# EAGLE design manga-screen (EAGLE 5.12)
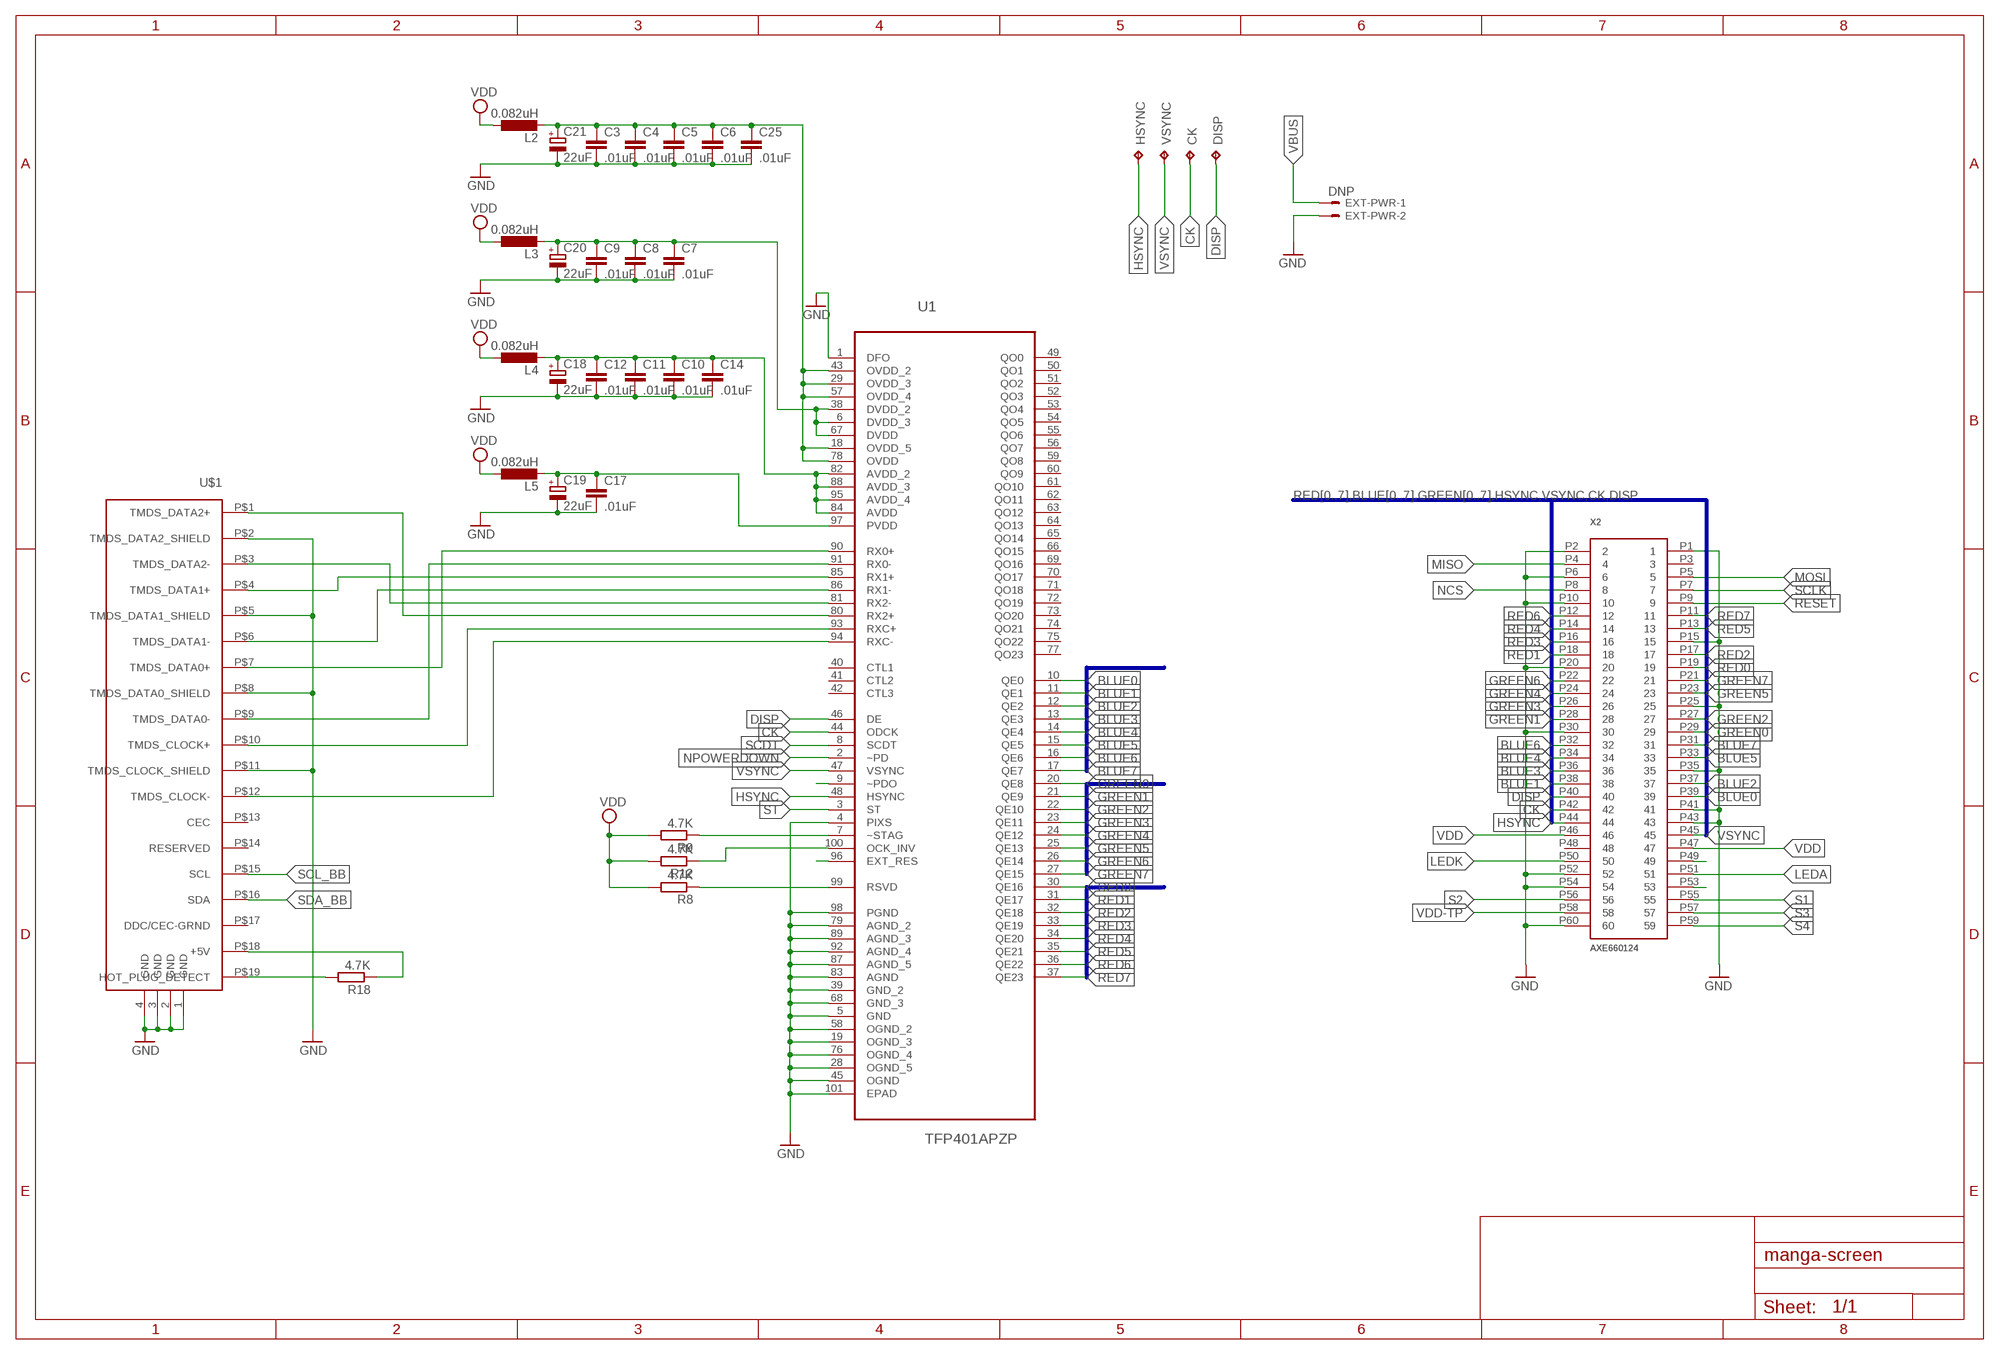
[diagram p0: schematic, sheet 1, part 1 of 2]
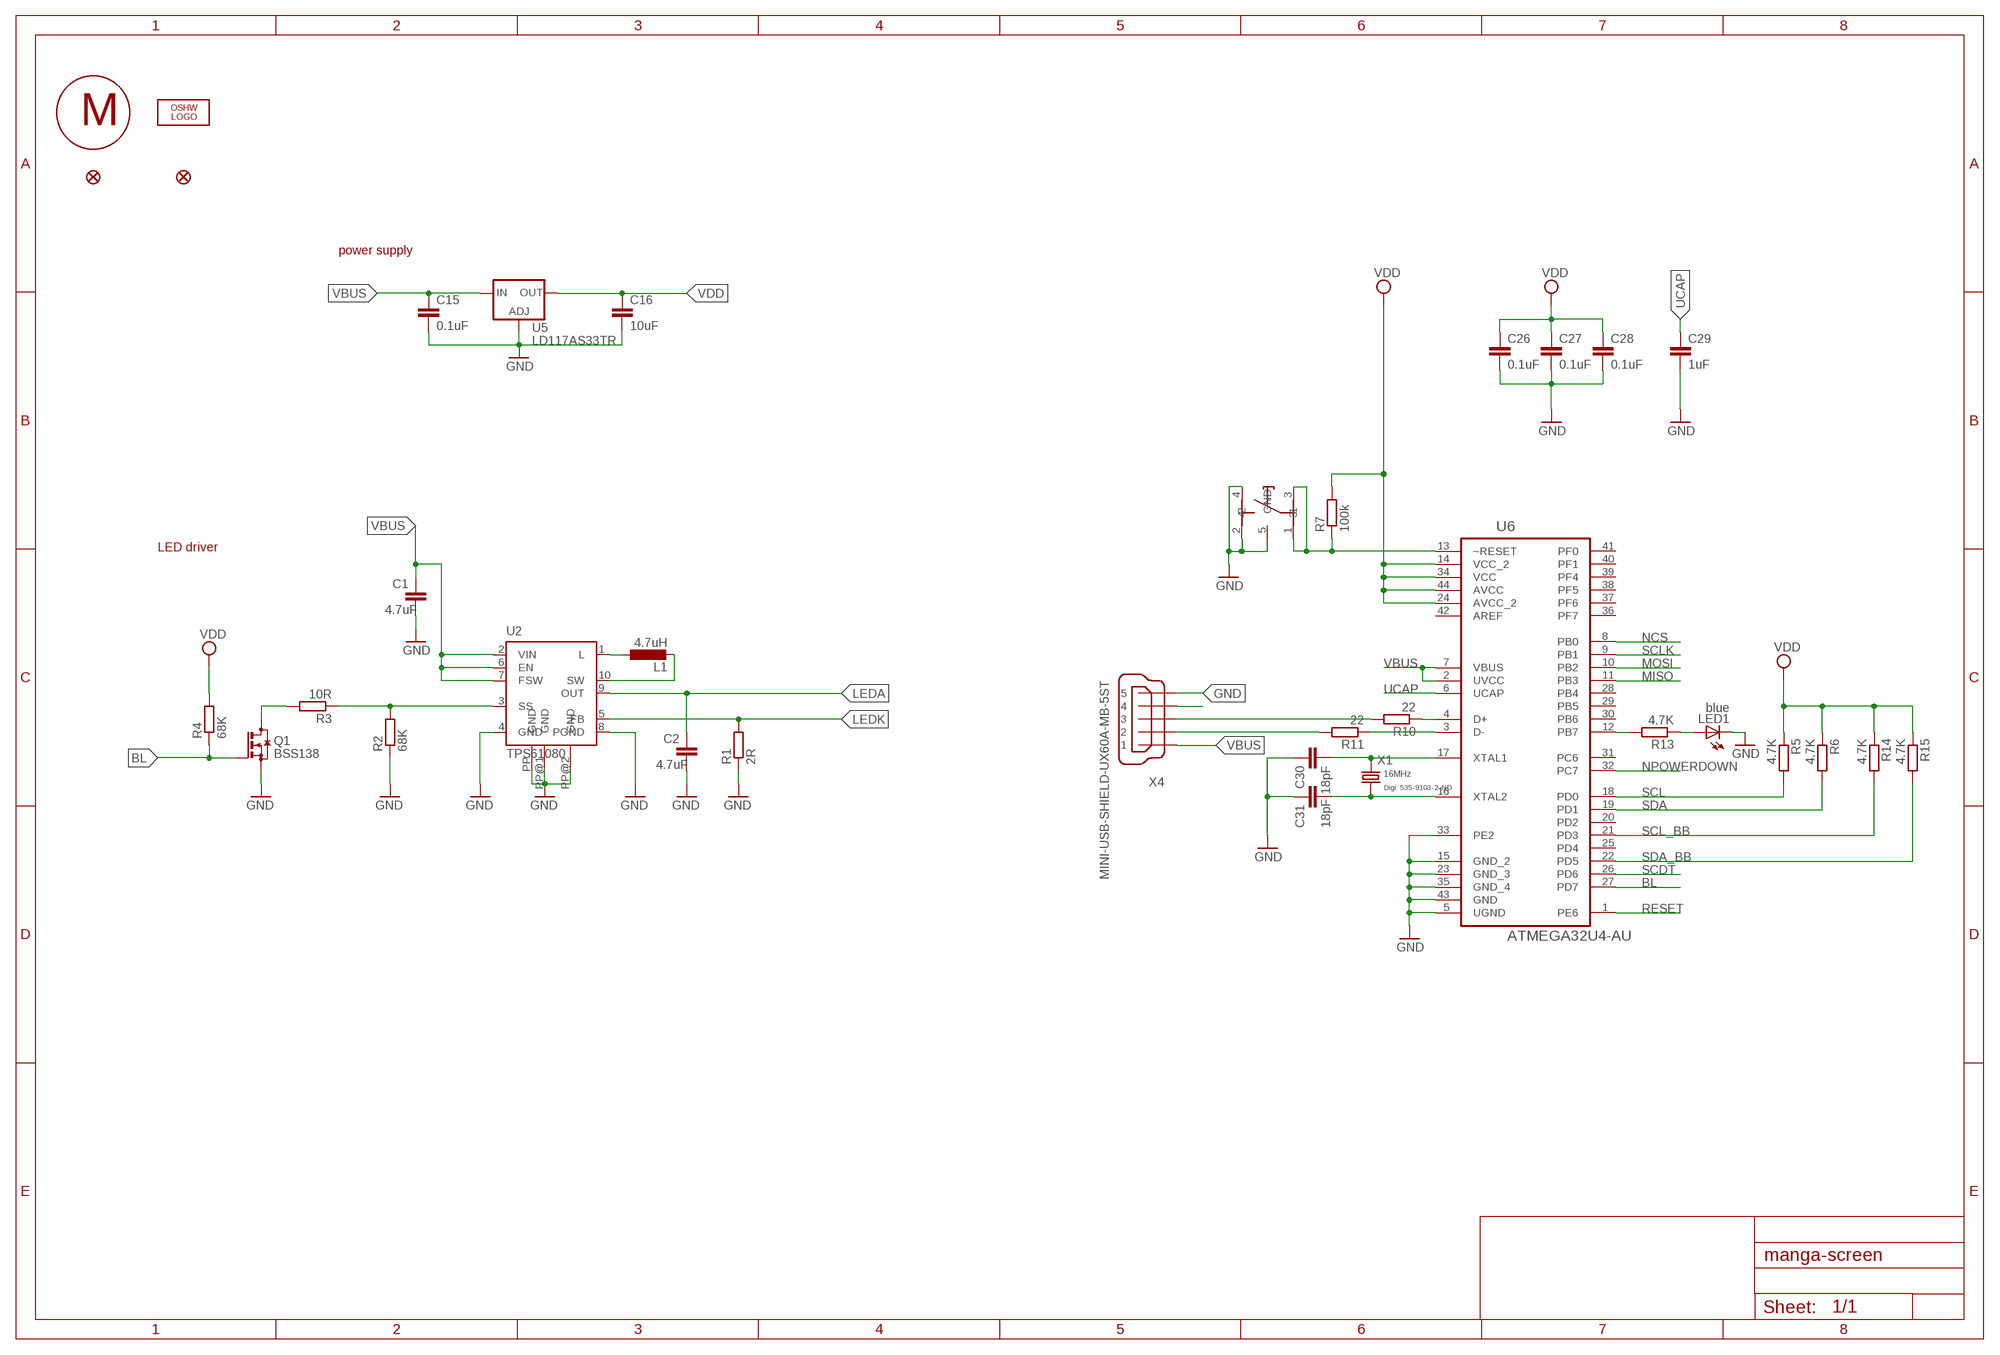
[diagram p1: schematic, sheet 1, part 2 of 2]

## Parts
C1  4.7uF  C-EUC0402  [C0402]
C2  4.7uF  C-EUC0402  [C0402]
C3  .01uF  C-EUC0402  [C0402]
C4  .01uF  C-EUC0402  [C0402]
C5  .01uF  C-EUC0402  [C0402]
C6  .01uF  C-EUC0402  [C0402]
C7  .01uF  C-EUC0402  [C0402]
C8  .01uF  C-EUC0402  [C0402]
C9  .01uF  C-EUC0402  [C0402]
C10  .01uF  C-EUC0402  [C0402]
C11  .01uF  C-EUC0402  [C0402]
C12  .01uF  C-EUC0402  [C0402]
C14  .01uF  C-EUC0402  [C0402]
C15  0.1uF  C-EUC0402  [C0402]
C16  10uF  C-EUC0805  [C0805]
C17  .01uF  C-EUC0402  [C0402]
C18  22uF  CPOL-EUCT3216  [CT3216]
C19  22uF  CPOL-EUCT3216  [CT3216]
C20  22uF  CPOL-EUCT3216  [CT3216]
C21  22uF  CPOL-EUCT3216  [CT3216]
C25  .01uF  C-EUC0402  [C0402]
C26  0.1uF  C-EUC0402  [C0402]
C27  0.1uF  C-EUC0402  [C0402]
C28  0.1uF  C-EUC0402  [C0402]
C29  1uF  C-EUC0402  [C0402]
C30  18pF  C-EUC0402  [C0402]
C31  18pF  C-EUC0402  [C0402]
CK  TPB1,27  [B1,27]
DISP  TPB1,27  [B1,27]
EXT-PWR  DNP  22-27-2021-02  [6410-02]
HSYNC  TPB1,27  [B1,27]
JP1  FIDUCIAL1X2  [FIDUCIAL-1X2]
JP2  FIDUCIAL1X2  [FIDUCIAL-1X2]
L1  4.7uH  L-EUL2825P  [L2825P]
L2  0.082uH  L-EUL2012C  [L2012C]
L3  0.082uH  L-EUL2012C  [L2012C]
L4  0.082uH  L-EUL2012C  [L2012C]
L5  0.082uH  L-EUL2012C  [L2012C]
LED1  blue  LEDCHIP-LED0603  [CHIP-LED0603]
LOGO2  OSHW_LOGO_10MILX0200-NT  [OSHW_10X200_NOTEXT]
Q1  BSS138  BSS123  [SOT23]
R1  2R  R-EU_R0402  [R0402]
R2  68K  R-EU_R0402  [R0402]
R3  10R  R-EU_R0402  [R0402]
R4  68K  R-EU_R0402  [R0402]
R5  4.7K  R-EU_R0402  [R0402]
R6  4.7K  R-EU_R0402  [R0402]
R7  100k  R-EU_R0402  [R0402]
R8  4.7K  R-EU_R0402  [R0402]
R9  4.7K  R-EU_R0402  [R0402]
R10  22  R-EU_R0402  [R0402]
R11  22  R-EU_R0402  [R0402]
R12  4.7K  R-EU_R0402  [R0402]
R13  4.7K  R-EU_R0402  [R0402]
R14  4.7K  R-EU_R0402  [R0402]
R15  4.7K  R-EU_R0402  [R0402]
R18  4.7K  R-EU_R0402  [R0402]
S1  KRM_TACT_SWITCH  [KMR]
U1  TFP401APZP  [QFP50P1600X1600X120-101N]
U2  TPS61080  [S-PDSO-N10]
U5  LD117AS33TR  [SOT223]
U6  ATMEGA32U4-AU  [QFP80P1200X1200X120-44N]
U$1  HDMI  [FCI-HDMI]
U$2  MANGA-GRAPHIC  [MANGA]
VSYNC  TPB1,27  [B1,27]
X1  16MHz  CRYSTAL-5.08X3.18  [2P-SMD-5.08X3.18]
X2  AXE660124  AXE660124SOCKET  [AXE560124]
X4  MINI-USB-SHIELD-UX60A-MB-5ST  [UX60A-MB-5ST]

## Nets
BL: Q1.1(G) R4.1 U6.27(PD7)
BLUE0: U1.10(QE0) X2.P39
BLUE1: U1.11(QE1) X2.P38
BLUE2: U1.12(QE2) X2.P37
BLUE3: U1.13(QE3) X2.P36
BLUE4: U1.14(QE4) X2.P34
BLUE5: U1.15(QE5) X2.P33
BLUE6: U1.16(QE6) X2.P32
BLUE7: U1.17(QE7) X2.P31
CK: CK.TP U1.44(ODCK) X2.P42
D+: R10.2 X4.3
D-: R11.2 X4.2
DISP: DISP.TP U1.46(DE) X2.P40
DM: R11.1 U6.3(D-)
DP: R10.1 U6.4(D+)
GND: C1.2 C2.2 C3.2 C4.2 C5.2 C6.2 C7.2 C8.2 C9.2 C10.2 C11.2 C12.2 C14.2 C15.2 C16.2 C17.2 C18.- C19.- C20.- C21.- C25.2 C26.2 C27.2 C28.2 C29.2 C30.1 C31.1 EXT-PWR.2 LED1.C Q1.2(S) R1.1 R2.1 S1.2 S1.4 S1.5(GND) U1.1(DFO) U1.4(PIXS) U1.5(GND) U1.19(OGND_3) U1.28(OGND_5) U1.39(GND_2) U1.45(OGND) U1.58(OGND_2) U1.68(GND_3) U1.76(OGND_4) U1.79(AGND_2) U1.83(AGND) U1.87(AGND_5) U1.89(AGND_3) U1.92(AGND_4) U1.98(PGND) U1.101(EPAD) U2.4(GND) U2.8(PGND) U2.PP(GND) U2.PP@1(GND) U2.PP@2(GND) U5.1(ADJ) U6.5(UGND) U6.15(GND_2) U6.23(GND_3) U6.33(PE2) U6.35(GND_4) U6.43(GND) U$1.1(GND) U$1.2(GND) U$1.3(GND) U$1.4(GND) U$1.P$2(TMDS_DATA2_SHIELD) U$1.P$5(TMDS_DATA1_SHIELD) U$1.P$8(TMDS_DATA0_SHIELD) U$1.P$11(TMDS_CLOCK_SHIELD) X2.P1 X2.P2 X2.P6 X2.P10 X2.P15 X2.P20 X2.P25 X2.P30 X2.P35 X2.P41 X2.P43 X2.P52 X2.P54 X2.P60 X4.5
GREEN0: U1.20(QE8) X2.P29
GREEN1: U1.21(QE9) X2.P28
GREEN2: U1.22(QE10) X2.P27
GREEN3: U1.23(QE11) X2.P26
GREEN4: U1.24(QE12) X2.P24
GREEN5: U1.25(QE13) X2.P23
GREEN6: U1.26(QE14) X2.P22
GREEN7: U1.27(QE15) X2.P21
HSYNC: HSYNC.TP U1.48(HSYNC) X2.P44
LEDA: C2.1 U2.9(OUT) X2.P51
LEDK: R1.2 U2.5(FB) X2.P50
MISO: U6.11(PB3) X2.P4
MOSI: U6.10(PB2) X2.P5
N$1: L1.1 U2.1(L)
N$2: L1.2 U2.10(SW)
N$3: R12.1 U1.100(OCK_INV)
N$4: R2.2 R3.1 U2.3(SS)
N$5: U1.9(~PDO)
N$6: Q1.3(D) R3.2
N$7: R7.1 S1.1 S1.3 U6.13(~RESET)
N$8: R13.2 U6.12(PB7)
N$9: LED1.A R13.1
N$10: R9.1 U1.7(~STAG)
N$11: R8.1 U1.99(RSVD)
N$12: X2.P53
N$13: X2.P49
N$14: C31.2 U6.16(XTAL2) X1.X2
N$15: X4.4
N$16: C30.2 U6.17(XTAL1) X1.X1
N$17: R18.1 U$1.P$18(+5V)
N$19: C7.1 C8.1 C9.1 C20.+ L3.2 U1.6(DVDD_3) U1.38(DVDD_2) U1.67(DVDD)
N$20: C3.1 C4.1 C5.1 C6.1 C21.+ C25.1 L2.2 U1.18(OVDD_5) U1.29(OVDD_3) U1.43(OVDD_2) U1.57(OVDD_4) U1.78(OVDD)
N$21: C10.1 C11.1 C12.1 C14.1 C18.+ L4.2 U1.82(AVDD_2) U1.84(AVDD) U1.88(AVDD_3) U1.95(AVDD_4)
N$22: C17.1 C19.+ L5.2 U1.97(PVDD)
N$23: U1.96(EXT_RES)
N$31: R18.2 U$1.P$19(HOT_PLUG_DETECT)
NCS: U6.8(PB0) X2.P8
NPOWERDOWN: U1.2(~PD) U6.32(PC7)
RED0: U1.30(QE16) X2.P19
RED1: U1.31(QE17) X2.P18
RED2: U1.32(QE18) X2.P17
RED3: U1.33(QE19) X2.P16
RED4: U1.34(QE20) X2.P14
RED5: U1.35(QE21) X2.P13
RED6: U1.36(QE22) X2.P12
RED7: U1.37(QE23) X2.P11
RESET: U6.1(PE6) X2.P9
S1: X2.P55
S2: X2.P56
S3: X2.P57
S4: X2.P59
SCDT: U1.8(SCDT) U6.26(PD6)
SCL: R5.2 U6.18(PD0)
SCL_BB: R14.2 U6.21(PD3) U$1.P$15(SCL)
SCLK: U6.9(PB1) X2.P7
SDA: R6.2 U6.19(PD1)
SDA_BB: R15.2 U6.22(PD5) U$1.P$16(SDA)
ST: U1.3(ST)
TMDS_CLOCK+: U1.93(RXC+) U$1.P$10(TMDS_CLOCK+)
TMDS_CLOCK-: U1.94(RXC-) U$1.P$12(TMDS_CLOCK-)
TMDS_DATA0+: U1.90(RX0+) U$1.P$7(TMDS_DATA0+)
TMDS_DATA0-: U1.91(RX0-) U$1.P$9(TMDS_DATA0-)
TMDS_DATA1+: U1.85(RX1+) U$1.P$4(TMDS_DATA1+)
TMDS_DATA1-: U1.86(RX1-) U$1.P$6(TMDS_DATA1-)
TMDS_DATA2+: U1.80(RX2+) U$1.P$1(TMDS_DATA2+)
TMDS_DATA2-: U1.81(RX2-) U$1.P$3(TMDS_DATA2-)
UCAP: C29.1 U6.6(UCAP)
VBUS: C1.1 C15.1 EXT-PWR.1 U2.2(VIN) U2.6(EN) U2.7(FSW) U5.3(IN) U6.2(UVCC) U6.7(VBUS) X4.1
VDD: C16.1 C26.1 C27.1 C28.1 L2.1 L3.1 L4.1 L5.1 R4.2 R5.1 R6.1 R7.2 R8.2 R9.2 R12.2 R14.1 R15.1 U5.4(OUT) U6.14(VCC_2) U6.24(AVCC_2) U6.34(VCC) U6.44(AVCC) X2.P46 X2.P47
VDD-TP: X2.P58
VSYNC: U1.47(VSYNC) VSYNC.TP X2.P45
Unconnected: U1.40(CTL1) U1.41(CTL2) U1.42(CTL3) U1.49(QO0) U1.50(QO1) U1.51(QO2) U1.52(QO3) U1.53(QO4) U1.54(QO5) U1.55(QO6) U1.56(QO7) U1.59(QO8) U1.60(QO9) U1.61(QO10) U1.62(QO11) U1.63(QO12) U1.64(QO13) U1.65(QO14) U1.66(QO15) U1.69(QO16) U1.70(QO17) U1.71(QO18) U1.72(QO19) U1.73(QO20) U1.74(QO21) U1.75(QO22) U1.77(QO23) U6.20(PD2) U6.25(PD4) U6.28(PB4) U6.29(PB5) U6.30(PB6) U6.31(PC6) U6.36(PF7) U6.37(PF6) U6.38(PF5) U6.39(PF4) U6.40(PF1) U6.41(PF0) U6.42(AREF) U$1.P$13(CEC) U$1.P$14(RESERVED) U$1.P$17(DDC/CEC-GRND) X2.P3 X2.P48 X4.M1(S1) X4.M2(S2) X4.M3(S3) X4.M4(S4)

## Buses
RED[0..7],BLUE[0..7],GREEN[0..7],HSYNC,VSYNC,CK,DISP
RED[0..7]
GREEN[0..7]
BLUE[0..7]

## Notes on the sheet
- power supply
- LED driver
- Digi: 535-9103-2-ND

## Library data of the parts
C1-C12 C14-C17 C25-C31 = rcl:C-EU: CAPACITOR, European symbol
C18-C21 = rcl:CPOL-EU: POLARIZED CAPACITOR, European symbol
CK DISP HSYNC VSYNC = testpad:TP: Test pad
EXT-PWR = con-molex:22-?-02: CONNECTOR wire to board 2.54 mm (.1 inch) pitch header; OC_FARNELL: unknown; OC_NEWARK: unknown
JP1 JP2 = SparkFun:FIDUCIAL: Fiducial Alignment Points Various fiducial points for machine vision alignment.
L1-L5 = rcl:L-EU: INDUCTOR, European symbol
LED1 = led:LED: LED OSRAM: - CHIPLED LG R971, LG N971, LY N971, LG Q971, LY Q971, LO R971, LY R971 LH N974, LH R974 LS Q976, LO Q976, LY Q976 LO Q996 - Hyper CHIPLED LW Q18S LB Q993, LB Q99A, LB R99A - SideLED LS A670, LO A670, LY A670, LG A670, LP A670 LB A673, LV A673, LT A673, LW A673 LH A674 LY A675 LS A676, LA A676, LO A676, LY A676, LW A676 LS A679, LY A679, LG A679 - Hyper Micro SIDELED® LS Y876, LA Y876, LO Y876, LY Y876 LT Y87S - SmartLED LW L88C, LW L88S LB L89C, LB L89S, LG L890 LS L89K, LO L89K, LY L89K LS L896, LA L896, LO L896, LY L896 - TOPLED LS T670, LO T670, LY T670, LG T670, LP T670 LSG T670, LSP T670, LSY T670, LOP T670, LYG T670 LG T671, LOG T671, LSG T671 LB T673, LV T673, LT T673, LW T673 LH T674 LS T676, LA T676, LO T676, LY T676, LB T676, LH T676, LSB T676, LW T676 LB T67C, LV T67C, LT T67C, LS T67K, LO T67K, LY T67K, LW E67C LS E67B, LA E67B, LO E67B, LY E67B, LB E67C, LV E67C, LT E67C LW T67C LS T679, LY T679, LG T679 LS T770, LO T770, LY T770, LG T770, LP T770 LB T773, LV T773, LT T773, LW T773 LH T774 LS E675, LA E675, LY E675, LS T675 LS T776, LA T776, LO T776, LY T776, LB T776 LHGB T686 LT T68C, LB T68C - Hyper Mini TOPLED® LB M676 - Mini TOPLED Santana® LG M470 LS M47K, LO M47K, LY M47K Source: http://www.osram.convergy.de LUXEON: - LUMILED® LXK2-PW12-R00, LXK2-PW12-S00, LXK2-PW14-U00, LXK2-PW14-V00 LXK2-PM12-R00, LXK2-PM12-S00, LXK2-PM14-U00 LXK2-PE12-Q00, LXK2-PE12-R00, LXK2-PE12-S00, LXK2-PE14-T00, LXK2-PE14-U00 LXK2-PB12-K00, LXK2-PB12-L00, LXK2-PB12-M00, LXK2-PB14-N00, LXK2-PB14-P00, LXK2-PB14-Q00 LXK2-PR12-L00, LXK2-PR12-M00, LXK2-PR14-Q00, LXK2-PR14-R00 LXK2-PD12-Q00, LXK2-PD12-R00, LXK2-PD12-S00 LXK2-PH12-R00, LXK2-PH12-S00 LXK2-PL12-P00, LXK2-PL12-Q00, LXK2-PL12-R00 Source: www.luxeon.com KINGBRIGHT: KA-3528ASYC Source: www.kingbright.com
LOGO2 = ohw-logo:OSHW_LOGO_10MIL
Q1 = transistor-small-signal:BSS123: N-CHANNEL MOS FET
R1-R6 R8-R15 R18 = rcl:R-EU_: RESISTOR, European symbol
R7 = resistor:R-EU_: RESISTOR, European symbol
S1 = custom:KRM_TACT_SWITCH: KRM tact switch http://no.farnell.com/c-k-components/kmr241g-lfs/tactile-switch-smd-4n/dp/1437637
U1 = ti-tfp401:TFP401APZP: DIGITAL RECEIVER; MPN: TFP401APZP; OC_FARNELL: 1470430; OC_NEWARK: 74K3959; PACKAGE: QFP-100; SUPPLIER: TEXAS INSTRUMENTS
U2 = texas:TPS6108*: HIGH VOLTAGE DC/DC BOOST CONVERTER WITH 0.5-A/1.3-A INTEGRATED SWITCH Source: www.ti.com .. tps61081[1].pdf; MPN: TPS61080DRCT; OC_FARNELL: 1412517; OC_NEWARK: 30M1831
U5 = v-reg:LD117A?*: Low drop fixed and adjustable positive voltage regulators 1 A Source: http://www.st.com/stonline/products/literature/ds/7194/ld1117axx.pdf
U6 = atmega32u4:ATMEGA32U4-AU: 8-bit Microcontroller with ISP Flash and USB Controller; MPN: ATMEGA32U4-AU; OC_FARNELL: 1748525; OC_NEWARK: 26R5633; PACKAGE: TQFP-44; SUPPLIER: Atmel
U$1 = hdmi:HDMI
U$2 = manga:MANGA-GRAPHIC
X1 = Seeed-Discrete:CRYSTAL*: CRYSTAL
X2 = replicape-display:AXE660124
X4 = con-hirose:MINI-USB-SHIELD-: MINI USB Connector Source: http://www.hirose.co.jp/cataloge_hp/e24000019.pdf; OC_FARNELL: unknown; OC_NEWARK: unknown

## Board
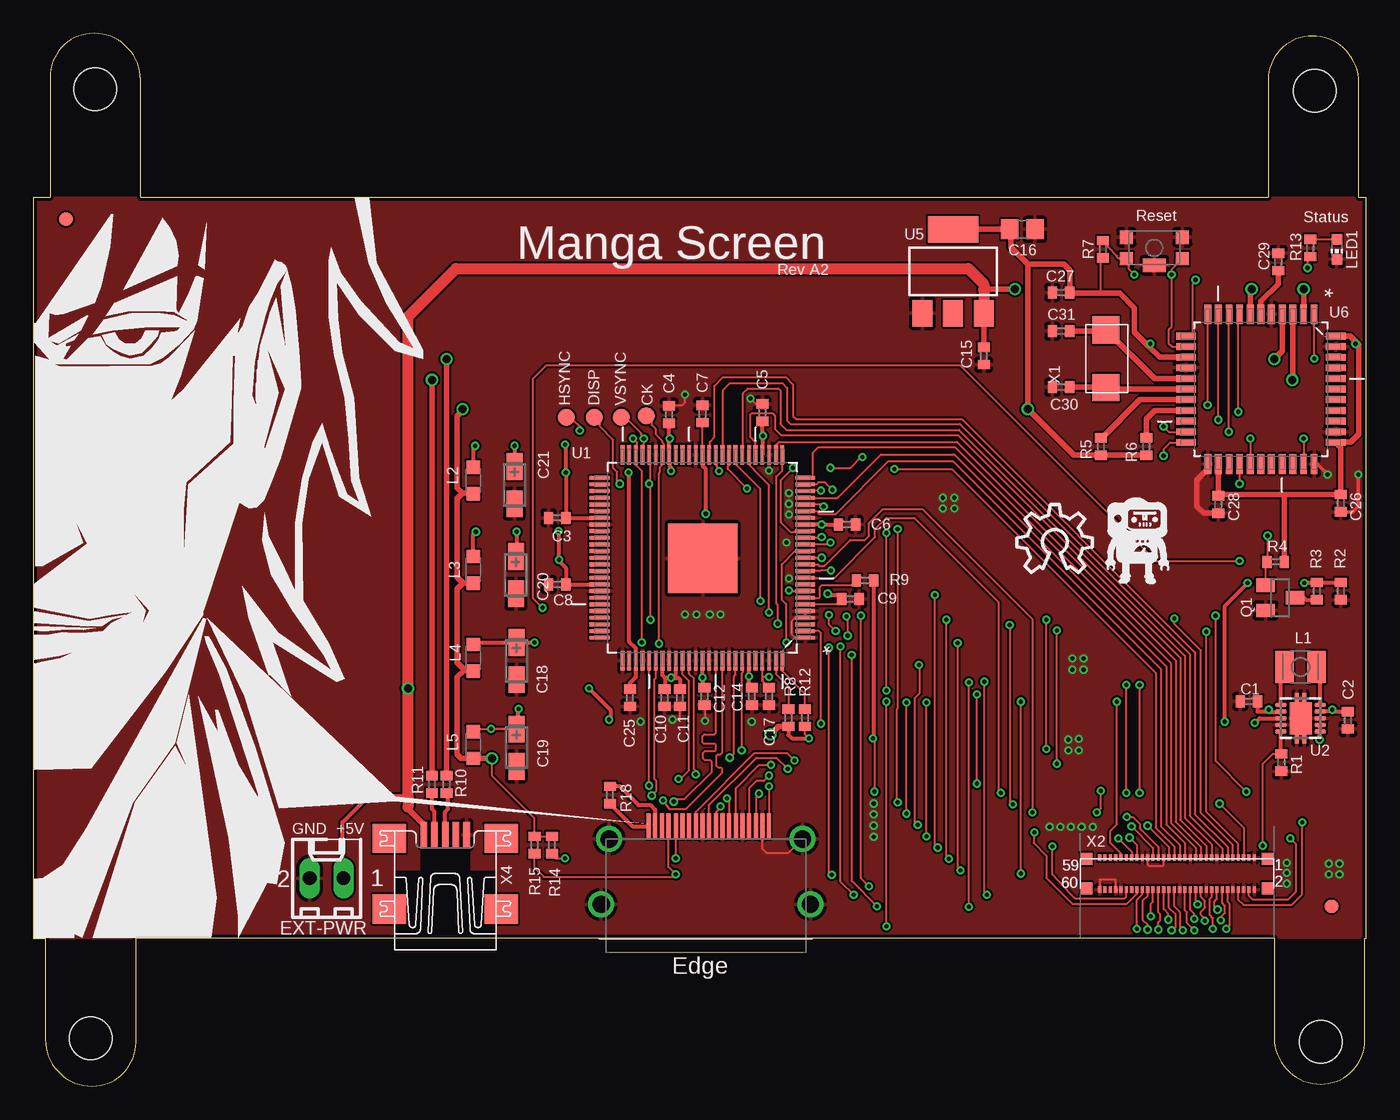
[diagram p2: board, top side]
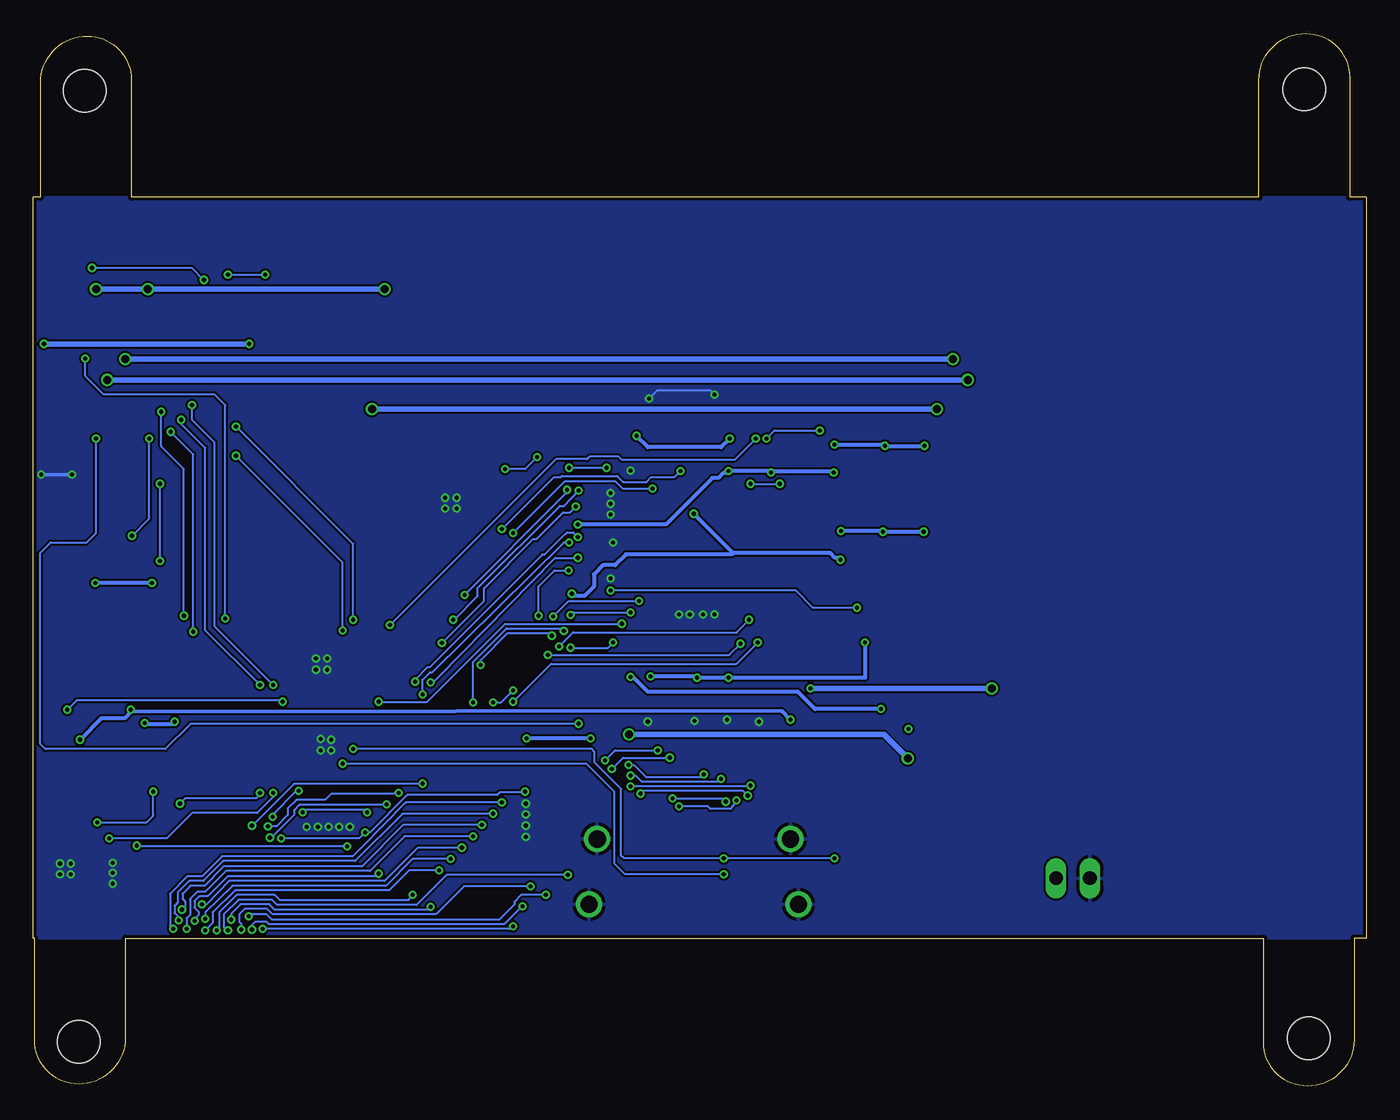
[diagram p3: board, bottom side, seen from below]

Size 100 x 79 mm. Coordinates in mm from the lower left corner, seen from the top.
Outline: 0,11.1 0.9,11.1 0.9,3.5 arc90 4.4,0 arc90 7.7,3.3 7.7,11.1 93.1,11.1 93.1,3.65 arc90 96.6,0.15 arc90 99.9,3.45 99.9,11.1 100,11.1 100,66.7 99.45,66.7 99.45,75.3 arc90 95.95,78.8 arc90 92.65,75.5 92.65,66.7 8.05,66.7 8.05,75.5 arc90 4.55,79 arc90 1.25,75.7 1.25,66.7 0,66.7 0,11.1
Copper layers (1*16): Top 0.035mm / dielectric 1.5mm / Bottom 0.035mm
Design rules "Fusion_eagle_rule_v1.1": minimum track width 6mil, minimum drill 12mil, track to track 6mil, track to pad 6mil, pad to pad 6mil, via to via 6mil, smd to smd 0mil, copper to edge 10mil, drill to drill 10mil, minimum pad ring 10mil, minimum via ring 6mil, stop-mask expansion 2mil, vias tented up to drill 100mil, thermal gap 10mil
Holes 3.2 mm at 4.65,74.8 4.3,3.6 96.15,74.7 96.6,3.35

### Footprints (pad centres in the part's own frame; a part is rotated, then mirrored left to right if it is on the bottom)
C0402 = smd 0.7 x 0.9: 1 -0.65,0; 2 0.65,0
C0805 = smd 1.3 x 1.5: 1 -0.95,0; 2 0.95,0
CT3216 = smd 2 x 1.2: + -1.4,0; - 1.4,0
B1,27 = smd 1.27 x 1.27: TP 0,0
6410-02 = drill 1.016 long: 1 1.27,0; 2 -1.27,0
FIDUCIAL-1X2 = smd 1 x 1: 1 0,0
L2825P = smd 1.4 x 2.4: 1 -1.2,0; 2 1.2,0
L2012C = smd 1 x 1: 1 -1,0; 2 1,0
CHIP-LED0603 = smd 0.8 x 0.8: A 0,-0.75; C 0,0.75
SOT23 = smd 1 x 1.4: 1 -0.95,-1.1; 2 0.95,-1.1; 3 0,1.1
R0402 = smd 0.7 x 0.9: 1 -0.65,0; 2 0.65,0
KMR = smd 1 x 1: 1 2.1,0.8; 2 2.1,-0.8; 3 -2.1,0.8; 4 -2.1,-0.8 | smd 1.7 x 1: 5 0,1.3
QFP50P1600X1600X120-101N = smd 1.473 x 0.279: 1 -7.722,5.994; 2 -7.722,5.512; 3 -7.722,5.004; 4 -7.722,4.496; 5 -7.722,3.988; 6 -7.722,3.505; 7 -7.722,2.997; 8 -7.722,2.489; 9 -7.722,2.007; 10 -7.722,1.499; 11 -7.722,0.991; 12 -7.722,0.508; 13 -7.722,0; 14 -7.722,-0.508; 15 -7.722,-0.991; 16 -7.722,-1.499; 17 -7.722,-2.007; 18 -7.722,-2.489; 19 -7.722,-2.997; 20 -7.722,-3.505; 21 -7.722,-3.988; 22 -7.722,-4.496; 23 -7.722,-5.004; 24 -7.722,-5.512; 25 -7.722,-5.994; 51 7.722,-5.994; 52 7.722,-5.512; 53 7.722,-5.004; 54 7.722,-4.496; 55 7.722,-3.988; 56 7.722,-3.505; 57 7.722,-2.997; 58 7.722,-2.489; 59 7.722,-2.007; 60 7.722,-1.499; 61 7.722,-0.991; 62 7.722,-0.508; 63 7.722,0; 64 7.722,0.508; 65 7.722,0.991; 66 7.722,1.499; 67 7.722,2.007; 68 7.722,2.489; 69 7.722,2.997; 70 7.722,3.505; 71 7.722,3.988; 72 7.722,4.496; 73 7.722,5.004; 74 7.722,5.512; 75 7.722,5.994 | smd 0.279 x 1.473: 26 -5.994,-7.722; 27 -5.512,-7.722; 28 -5.004,-7.722; 29 -4.496,-7.722; 30 -3.988,-7.722; 31 -3.505,-7.722; 32 -2.997,-7.722; 33 -2.489,-7.722; 34 -2.007,-7.722; 35 -1.499,-7.722; 36 -0.991,-7.722; 37 -0.508,-7.722; 38 0,-7.722; 39 0.508,-7.722; 40 0.991,-7.722; 41 1.499,-7.722; 42 2.007,-7.722; 43 2.489,-7.722; 44 2.997,-7.722; 45 3.505,-7.722; 46 3.988,-7.722; 47 4.496,-7.722; 48 5.004,-7.722; 49 5.512,-7.722; 50 5.994,-7.722; 76 5.994,7.722; 77 5.512,7.722; 78 5.004,7.722; 79 4.496,7.722; 80 3.988,7.722; 81 3.505,7.722; 82 2.997,7.722; 83 2.489,7.722; 84 2.007,7.722; 85 1.499,7.722; 86 0.991,7.722; 87 0.508,7.722; 88 0,7.722; 89 -0.508,7.722; 90 -0.991,7.722; 91 -1.499,7.722; 92 -2.007,7.722; 93 -2.489,7.722; 94 -2.997,7.722; 95 -3.505,7.722; 96 -3.988,7.722; 97 -4.496,7.722; 98 -5.004,7.722; 99 -5.512,7.722; 100 -5.994,7.722 | smd 5.207 x 5.207: 101 -0.025,0.051
S-PDSO-N10 = smd 0.28 x 0.85: 1 -1,-1.475; 2 -0.5,-1.475; 3 0,-1.475; 4 0.5,-1.475; 5 1,-1.475; 6 1,1.475; 7 0.5,1.475; 8 0,1.475; 9 -0.5,1.475; 10 -1,1.475 | smd 2.4 x 1.65: PP 0,0 | smd 3.8 x 0.28: PP@1 0,0.275; PP@2 0,-0.275
SOT223 = smd 1.5 x 2: 1 -2.3,-3.15; 2 0,-3.15; 3 2.3,-3.15 | smd 3.8 x 2: 4 0,3.15
QFP80P1200X1200X120-44N = smd 1.473 x 0.508: 1 -5.613,3.988; 2 -5.613,3.2; 3 -5.613,2.388; 4 -5.613,1.6; 5 -5.613,0.787; 6 -5.613,0; 7 -5.613,-0.787; 8 -5.613,-1.6; 9 -5.613,-2.388; 10 -5.613,-3.2; 11 -5.613,-3.988; 23 5.613,-3.988; 24 5.613,-3.2; 25 5.613,-2.388; 26 5.613,-1.6; 27 5.613,-0.787; 28 5.613,0; 29 5.613,0.787; 30 5.613,1.6; 31 5.613,2.388; 32 5.613,3.2; 33 5.613,3.988 | smd 0.508 x 1.473: 12 -3.988,-5.613; 13 -3.2,-5.613; 14 -2.388,-5.613; 15 -1.6,-5.613; 16 -0.787,-5.613; 17 0,-5.613; 18 0.787,-5.613; 19 1.6,-5.613; 20 2.388,-5.613; 21 3.2,-5.613; 22 3.988,-5.613; 34 3.988,5.613; 35 3.2,5.613; 36 2.388,5.613; 37 1.6,5.613; 38 0.787,5.613; 39 0,5.613; 40 -0.787,5.613; 41 -1.6,5.613; 42 -2.388,5.613; 43 -3.2,5.613; 44 -3.988,5.613
FCI-HDMI = drill 1.3 round: 1 1.1,7.85; 2 -3.8,7.25; 3 1.1,-7.85; 4 -3.8,-7.25 | smd 1.9 x 0.3: P$1 -4.76,4.75; P$2 -4.76,4.25; P$3 -4.76,3.75; P$4 -4.76,3.25; P$5 -4.76,2.75; P$6 -4.76,2.25; P$7 -4.76,1.75; P$8 -4.76,1.25; P$9 -4.76,0.75; P$10 -4.76,0.25; P$11 -4.76,-0.25; P$12 -4.76,-0.75; P$13 -4.76,-1.25; P$14 -4.76,-1.75; P$15 -4.76,-2.25; P$16 -4.76,-2.8; P$17 -4.76,-3.3; P$18 -4.76,-3.8; P$19 -4.76,-4.3
2P-SMD-5.08X3.18 = smd 2.032 x 2.032: X1 0.381,-1.524; X2 4.699,-1.524
AXE560124 = smd 0.9 x 0.92: 1 -6.8,1.1; 2 -6.8,-1.1; 3 6.8,1.1; 4 6.8,-1.1 | smd 0.23 x 0.5: P1 5.8,1.2; P2 5.8,-1.2; P3 5.4,1.2; P4 5.4,-1.2; P5 5,1.2; P6 5,-1.2; P7 4.6,1.2; P8 4.6,-1.2; P9 4.2,1.2; P10 4.2,-1.2; P11 3.8,1.2; P12 3.8,-1.2; P13 3.4,1.2; P14 3.4,-1.2; P15 3,1.2; P16 3,-1.2; P17 2.6,1.2; P18 2.6,-1.2; P19 2.2,1.2; P20 2.2,-1.2; P21 1.8,1.2; P22 1.8,-1.2; P23 1.4,1.2; P24 1.4,-1.2; P25 1,1.2; P26 1,-1.2; P27 0.6,1.2; P28 0.6,-1.2; P29 0.2,1.2; P30 0.2,-1.2; P31 -0.2,1.2; P32 -0.2,-1.2; P33 -0.6,1.2; P34 -0.6,-1.2; P35 -1,1.2; P36 -1,-1.2; P37 -1.4,1.2; P38 -1.4,-1.2; P39 -1.8,1.2; P40 -1.8,-1.2; P41 -2.2,1.2; P42 -2.2,-1.2; P43 -2.6,1.2; P44 -2.6,-1.2; P45 -3,1.2; P46 -3,-1.2; P47 -3.4,1.2; P48 -3.4,-1.2; P49 -3.8,1.2; P50 -3.8,-1.2; P51 -4.2,1.2; P52 -4.2,-1.2; P53 -4.6,1.2; P54 -4.6,-1.2; P55 -5,1.2; P56 -5,-1.2; P57 -5.4,1.2; P58 -5.4,-1.2; P59 -5.8,1.2; P60 -5.8,-1.2
UX60A-MB-5ST = smd 2 x 0.5: 1 2.25,1.6; 2 2.25,0.8; 3 2.25,0; 4 2.25,-0.8; 5 2.25,-1.6 | smd 2.2 x 2.5: M1 -3.3,-4.2; M2 -3.3,4.2; M3 2,4.2; M4 2,-4.2

### Placement (x,y rotation side)
C1  91.21,28.87 180 top
C2  98.63,27.46 270 top
C3  39.3,42.65 180 top
C4  47.7,50.4 90 top
C5  54.7,50.55 90 top
C6  61.05,42.15 0 top
C7  50.2,50.45 90 top
C8  39.3,37.65 180 top
C9  61.3,36.55 0 top
C10  47.35,29.15 270 top
C11  48.5,29.15 270 top
C12  50.35,29.25 270 top
C14  53.9,29.25 270 top
C15  71.3,54.8 270 top
C16  74.2,64.3 0 top
C17  55.2,29.25 270 top
C18  36.25,31.9 270 top
C19  36.25,25.4 270 top
C20  36.2,38.35 270 top
C21  36.1,45.1 270 top
C25  44.75,29.15 270 top
C26  98.1,43.75 270 top
C27  77.1,59.55 180 top
C28  88.9,43.65 270 top
C29  93.4,61.85 90 top
C30  77.1,52.45 0 top
C31  77.1,56.65 0 top
CK  46,50.3 0 top
DISP  42.1,50.2 0 top
EXT-PWR  22,15.6 0 top
HSYNC  40,50.2 0 top
JP1  2.45,65.05 0 top
JP2  97.4,13.5 0 top
L1  95.08,31.46 0 top
L2  33,45.45 90 top
L3  33,38.75 90 top
L4  33,32.15 90 top
L5  33,25.6 90 top
LED1  97.8,62.8 180 top
LOGO2  73.8,38.55 0 top
Q1  93.55,36.65 270 top
R1  93.64,24.28 90 top
R2  98.1,37.15 90 top
R3  96.3,37.15 270 top
R4  93.2,39.35 0 top
R5  80.1,48 90 top
R6  83.5,48 90 top
R7  80.25,62.8 270 top
R8  56.65,27.65 270 top
R9  62.4,37.95 0 top
R10  31,22.65 270 top
R11  29.9,22.65 270 top
R12  57.9,27.65 270 top
R13  95.8,62.9 270 top
R14  38.9,18.1 270 top
R15  37.6,18.1 270 top
R18  43.25,21.85 270 top
S1  84.1,62.9 180 top
U1  50.2,39.65 180 top
U2  95.08,27.61 270 top
U5  69,61.15 0 top
U6  92.1,52.3 270 top
U$1  50.45,14.75 270 top
U$2  0.05,11.05 0 top
U$3  [LOGO_BIG]  82.4,41 0 top
VSYNC  44.1,50.2 270 top
X1  78.95,52.05 90 top
X2  85.8,15.95 0 top
X4  30.9,16.6 90 top

### Tracks (layer width: path | path; a pad name or v marks a point on that pad's centre or on a via)
BL  (via drill 0.3)
  Top 0.152: Q1.1 92.45,39.25 R4.1 92.6,39.4 v92.6,41.3 | U6.27 91.31,48.59 v91.3,48.6
  Bottom 0.152: v91.3,48.6 91.3,42.6 v92.6,41.3
BLUE0  (via drill 0.3)
  Top 0.152: X2.P39 84,17.9 v82.4,19.5 | v72.6,22 72.4,22.2 72.4,36.35 66.1,42.65 64,42.65 63.15,41.8 63.15,41.2 60.1,38.15 57.95,38.15 U1.10
  Bottom 0.152: v82.4,19.5 81.75,19.5 80.9,20.35 80.9,20.85 80.25,21.5 78.1,21.5 77.65,21.95 72.65,21.95 v72.6,22
BLUE1  (via drill 0.3)
  Top 0.152: X2.P38 84.4,13.05 84.55,12.9 84.55,12.45 84.4,12.3 v84.4,11.75 | 57.95,38.65 U1.11 58,38.65 59,38.65 59.1,38.7 v59.85,38.7 | v62.1,35.3 62.1,15.6 v62.7,15
  Bottom 0.152: v84.4,11.75 84.4,12.2 84.55,12.35 84.55,12.9 84.15,13.3 82.45,13.3 82.05,12.9 69.85,12.9 69.8,12.95 69.75,12.95 67.7,15 v62.7,15 | v59.85,38.7 60.9,38.7 62.1,37.5 v62.1,35.3
BLUE2  (via drill 0.3)
  Top 0.152: X2.P37 84.4,17.95 83,19.35 83,19.7 82.5,20.2 v82.05,20.2 | v79.8,20.55 80.1,20.85 v80.1,22.15 | U1.12 57.95,39.15 58.85,39.15 58.95,39.05 59.35,39.05 61.3,41 62.4,41 62.7,41.3 62.7,42.25 63.75,43.3 66.7,43.3 74.95,35.05 v74.95,20.55
  Bottom 0.152: v82.05,20.2 82.05,20.35 80.3,22.15 v80.1,22.15 | v74.95,20.55 75.15,20.75 79.6,20.75 v79.8,20.55
BLUE3  (via drill 0.3)
  Top 0.152: X2.P36 84.8,13.3 85.15,12.95 v85.15,12.5 | v59.15,39.65 U1.13 | v70.2,13.45 v70.2,30.3
  Bottom 0.152: v85.15,12.5 85.15,12.95 84.45,13.65 82.3,13.65 81.9,13.25 70.4,13.25 v70.2,13.45 | v59.15,39.65 60.85,39.65 69.6,30.7 70,30.3 v70.2,30.3
BLUE4  (via drill 0.3)
  Top 0.152: X2.P34 85.2,13.4 85.7,12.9 85.7,11.95 v85.4,11.7 | v56.5,33.3 56.5,36.2 56.45,36.2 56.15,36.5 56.15,39.15 57.15,40.15 57.9,40.15 U1.14 | v59.7,32.9 59.7,16.05 v59.9,15.85
  Bottom 0.152: v85.4,11.7 85.7,11.95 85.7,12.9 84.6,14 82.1,14 81.7,13.6 71.25,13.6 69,15.85 v59.9,15.85 | v56.5,33.3 56.9,32.9 v59.7,32.9
BLUE5  (via drill 0.3)
  Top 0.152: U1.15 59.64,40.64 v59.8,40.8 | v70.8,22.7 v70.8,29.4 | v83.6,19.55 85.2,17.95 X2.P33
  Bottom 0.152: v59.8,40.8 60.2,40.8 70.1,31.05 70.25,31.05 70.8,30.5 v70.8,29.4 | v70.8,22.7 80.45,22.7 v83.6,19.55
BLUE6  (via drill 0.3)
  Top 0.152: X2.P32 85.6,13.5 86.05,13.05 86.05,11.9 v86.25,11.7 | v59.15,41.2 59.1,41.15 57.95,41.15 U1.16 | v71.35,30.35 71.35,14.4 v71.55,14.35
  Bottom 0.152: v86.25,11.7 86.05,11.9 86.05,13.05 84.75,14.35 81.9,14.35 81.5,13.95 71.85,13.95 v71.55,14.35 | v59.15,41.2 59.5,41.55 59.95,41.55 60.35,41.2 61.65,39.9 61.8,39.9 70.25,31.45 70.4,31.45 71.35,30.5 v71.35,30.35
BLUE7  (via drill 0.3)
  Top 0.152: U1.17 57.9,41.65 57.15,41.65 57.05,41.55 56.85,41.55 56.1,42.3 56.1,45.5 v57,46.4 | X2.P31 85.6,18 84.2,19.4 84.2,31 68.9,46.3 v64.6,46.3 | v62.2,47.2 62.1,47.2 61.3,46.4 v59.8,46.4
  Bottom 0.152: v64.6,46.3 63.1,46.3 v62.2,47.2 | v57,46.4 v59.8,46.4
CK  (via drill 0.3)
  Top 0.152: X2.P42 83.6,14.3 83.25,13.95 83.25,12.45 83.6,12.1 v83.6,11.75 | v46.95,33.2 46.95,46 47,46.05 47,46.45 47.2,46.65 47.2,47.35 U1.44 47.3,47.4 47.3,48.2 47.2,48.3 47.2,48.4 46.7,48.9 46.7,49.3 46.4,49.6 46.4,50.3 CK.TP | v61.4,32.35 61.4,15.4 v63.3,13.5
  Bottom 0.152: v83.6,11.75 83.6,12.1 83.35,12.35 82.5,12.35 82.3,12.15 64.7,12.15 63.35,13.5 v63.3,13.5 | v61.4,32.35 47.8,32.35 v46.95,33.2 46.95,33.25
D+
  Top 0.305: X4.3 30.9,20.6 31.1,20.8 31.1,21.9 R10.2
D-
  Top 0.305: X4.2 30.1,20.6 29.9,20.8 R11.2
DISP  (via drill 0.3)
  Top 0.152: v83.85,12.75 83.85,13.7 84,13.85 X2.P40 | 46.3,46.55 46.2,46.65 46.2,47.35 U1.46 46.3,47.28 46.3,45.2 | v60.55,33 60.55,15.35 v61.55,14.35 | v46.3,35 46.3,45.2 | DISP.TP 42.5,50.2 42.5,49.5 43.5,48.5 43.5,46.4 43.8,46.1 43.8,45.4 v44,45.2 | 46.3,45.2 v46.2,45.2
  Bottom 0.152: v83.85,12.75 83.85,12.9 82.5,12.9 82.1,12.5 65.05,12.5 63.9,13.65 63.9,13.85 63.4,14.35 v61.55,14.35 | v60.55,33 59.5,34.05 47.2,34.05 47.2,34.1 v46.3,35 46.2,34.9 | v46.2,45.2 v44,45.2
DM  (via drill 0.6)
  Top 0.406: U6.3 94.49,53.04 v94.45,53 | R11.1 v29.9,53
  Bottom 0.406: v29.9,53 v94.45,53
DP  (via drill 0.6)
  Top 0.406: U6.4 93.7,55.15 v93.1,54.55 | 30.95,54.55 v31,54.55 R10.1
  Bottom 0.406: v31,54.55 v93.1,54.55
GND  (via drill 0.3)
  Top 0.152: C12.2 50.4,28.6 v50.4,27.4 | C11.2 48.5,27.55 47.95,27.55 v47.95,27.5 | X2.P41 83.6,16.65 83.7,16.55 84.75,16.55 84.8,16.6 X2.P35 | U$1.P$2 54.7,17.8 55,17.5 56.65,17.5 U$1.2 | C5.2 54.2,51.2 v53.8,51.6 | v48.9,51.9 48.9,51.3 48.7,51.1 47.75,51.1 C4.2 | X2.P54 81.2,15.5 80,15.5 X2.P60 | U1.5 U1.4 57.87,35.1 57.1,35.1 56.9,34.9 56.9,33.9 57.14,33.66 U1.1
  Top 0.254: U6.33 96.31,46.69 v97.1,45.9 | v99.4,45.9 99.4,43.5 99,43.1 C26.2
  Top 0.406: U6.23 88.11,46.31 87.3,45.5 87.3,43.5 87.8,43 C28.2
  Bottom 0.152: v50.4,27.4 50.35,27.4 50.35,27.6 | v47.95,27.5 48,27.5 48,27.2 | v53.8,51.6 53.2,52.2 49.2,52.2 v48.9,51.9
  Bottom 0.254: v97.1,45.9 v99.4,45.9
  other vias: 53.9,27.35 56.7,42.9 56.7,43.7 56.7,44.5 55.2,46.2 77.05,19.45 77.85,19.45 78.65,19.45 79.5,19.45 76.25,19.45 56.5,40.8 56.7,38.1 49.75,35.4 50.75,35.4 51.55,35.4 48.9,35.4 63.05,21.2 63.05,20.4 63.05,19.55 63.05,18.7 77.65,26 78.45,26.05 77.65,25.2 78.45,25.2 98,16.7 97.2,16.7 97.2,15.9 98,15.9 77.95,32.1 78.8,32.1 78.8,31.25 77.95,31.25 68.25,44.15 69.1,44.15 69.1,43.35 68.25,43.35 94.05,15.2 94.05,16.75 94.05,16 45.55,27.35
  pour Bottom: -0.05,66.7 100,66.7 100,11.1 0.05,11.1
  pour Top: -0.05,66.7 100,66.7 100,11.1 0.05,11.1
GREEN0
  Top 0.152: U1.20 57.95,43.15 58.75,43.15 58.95,42.95 60.2,42.95 64.15,46.9 69,46.9 84.6,31.3 84.6,19.5 86,18.1 X2.P29
GREEN1  (via drill 0.3)
  Top 0.152: X2.P28 86.4,13.2 86.55,13.05 86.55,12.25 v87.1,11.7 | v59.3,43.5 59.15,43.65 57.95,43.65 U1.21 | v69.35,33.25 69.35,16.4 v69.55,16.2
  Bottom 0.152: v87.1,11.7 86.55,12.25 86.55,13.05 84.85,14.7 73.3,14.7 71.8,16.2 v69.55,16.2 | v59.3,43.5 59.75,43.05 60.25,43.05 62.25,41.05 62.5,41.05 66.2,37.35 66.2,36.4 v69.35,33.25
GREEN2
  Top 0.152: X2.P27 86.4,18.25 85,19.65 85,31.5 69.1,47.4 63.6,47.4 60.35,44.15 U1.22
GREEN3  (via drill 0.3)
  Top 0.152: X2.P26 86.8,13.25 87.1,12.95 v87.1,12.55 | v59.1,44.7 57.95,44.65 U1.23 | v68.5,35 68.5,17.25 v68.7,17.05
  Bottom 0.152: v87.1,12.55 87.1,13.05 85.05,15.05 73.55,15.05 71.55,17.05 v68.7,17.05 | v59.1,44.7 60.2,43.55 60.5,43.55 66.65,37.4 66.65,36.8 68.45,35 v68.5,35
GREEN4  (via drill 0.3)
  Top 0.152: X2.P24 87.2,13.75 v87.35,13.65 | v59.95,44.75 59.4,45.3 58.9,45.3 58.75,45.15 57.95,45.15 U1.24 | v67.65,36.85 67.65,18.1 v67.85,17.9
  Bottom 0.152: v87.35,13.65 87,13.65 85.3,15.4 73.65,15.4 71.15,17.9 v67.85,17.9 | v59.95,44.75 59.95,44.6 60.4,44.15 v67.65,36.85
GREEN5
  Top 0.152: X2.P23 87.2,17.9 85.35,19.75 85.35,31.75 69.15,47.95 58.9,47.95 58.5,47.55 58.5,45.7 57.98,45.7 U1.25
GREEN6  (via drill 0.3)
  Top 0.152: v87.9,12.4 87.9,12.55 87.6,12.85 87.6,13.1 87.9,13.4 87.9,13.9 87.6,14.2 X2.P22 | v55.85,34.7 55.85,36.1 55.75,36.2 55.75,45.75 56.2,46.2 56.2,47.35 U1.26 | v74.1,15.95 v74.1,28.85
  Bottom 0.152: v87.9,12.4 87.9,12.55 87.6,12.85 87.6,13.1 87.9,13.4 87.9,13.9 87.55,14.25 86.9,14.25 85.4,15.75 74.3,15.75 v74.1,15.95 | v55.85,34.7 64.6,34.7 70.45,28.85 v74.1,28.85
GREEN7
  Top 0.152: X2.P21 87.6,17.95 85.7,19.85 85.7,31.95 69.3,48.35 55.95,48.35 55.75,48.15 55.75,47.41 U1.27
HSYNC  (via drill 0.3)
  Top 0.152: X2.P44 83.2,14.4 82.8,14 v82.8,11.8 | v45.65,33.3 45.65,46.15 45.2,46.6 45.2,47.35 U1.48 45.2,47.4 45.2,47.7 45.3,47.8 45.3,48.3 v45,48.6 | v64,12 v64,28.85 | HSYNC.TP 40.5,50.2 40.5,50 41,49.5 v41,49.2
  Bottom 0.152: v82.8,11.8 64.25,11.8 64.05,12 v64,12 | v45.65,33.3 47.25,31.7 61.15,31.7 v64,28.85 | v41,49.2 44.4,49.2 v45,48.6
LEDA  (via drill 0.3)
  Top 0.152: v81.3,28.85 81.3,19.65 80.8,19.15 80.8,18.25 81.55,17.5 81.55,17.45 81.6,17.4 X2.P51 | v97.45,28.25 97.45,28.11
  Top 0.3: C2.1 97.45,28.11 U2.9
  Bottom 0.152: v97.45,28.25 96.75,28.95 81.4,28.95 v81.3,28.85
LEDK  (via drill 0.3)
  Top 0.152: X2.P50 82,14.2 81.9,14.1 78.15,14.1 77.8,14.45 76.45,15.9 v76.45,18 | v92.25,18.05 92.25,24.2 93,24.95 93.45,24.95 R1.2
  Top 0.3: U2.5 93.6,25 93.55,24.95 93.6,24.9 R1.2
  Bottom 0.152: v92.25,18.05 92.2,18 v76.45,18
MISO  (via drill 0.3)
  Top 0.152: U6.11 88.11,51.11 v88.1,51.1 | v82,22 v82,30.1 | X2.P4 91.2,14.3 91.5,14 94.1,14 94.7,14.6 94.7,18.2 v94.3,18.6
  Bottom 0.152: v94.3,18.6 90,18.6 88.1,20.5 83.2,20.5 82,21.7 v82,22 | v88.1,51.1 88.1,50 86.4,48.3 86.4,34.5 v82,30.1
MOSI  (via drill 0.3)
  Top 0.152: v88.9,50 U6.10 | v88.9,50 | v83,22 v83,30.1 | X2.P5 90.8,19.4 v89,21.2
  Bottom 0.152: v88.9,50 88.9,49.7 87.1,47.9 87.1,34.2 v83,30.1 | v83,22 83,21.9 83.3,21.6 88.6,21.6 v89,21.2
N$1
  Top 0.3: U2.1 93.6,31.18 L1.1
N$2
  Top 0.3: U2.10 96.55,31.18 L1.2
N$3
  Top 0.152: U1.100 56.19,31.16 57.9,29.45 R12.1
N$4  (via drill 0.3)
  Top 0.3: R2.2 R3.1 95.4,37.8 v95.35,37.75 | v91.65,27.25 92,27.6 U2.3 | v89.4,27.35 89.4,36.05 v91.1,37.75
  Bottom 0.3: v91.65,27.25 91.55,27.15 89.6,27.15 v89.4,27.35 | v91.1,37.75 v95.35,37.75
N$6
  Top 0.3: R3.2 95.5,36.5 95.35,36.65 Q1.3
N$7  (via drill 0.3)
  Top 0.152: S1.3 85.8,62.1 85.8,61.7 85.4,61.3 v85.4,60.9 85.4,57 85.2,56.8 85.2,55.7 85.4,55.5 86.4,55.5 U6.13 | v82.6,60.9 82.2,61.3 82.2,62.1 S1.1 81.4,62.1 81.3,62.2 81.3,62.3 80.6,63 80.6,63.5 80.3,63.5 R7.1
  Bottom 0.152: v85.4,60.9 v82.6,60.9
N$8  (via drill 0.3)
  Top 0.152: v87.2,60.5 87.2,60.4 87,60.2 87,56.3 U6.12 | v95.6,61.4 95.6,62.3 95.8,62.3 R13.2
  Bottom 0.152: v87.2,60.5 88.1,61.4 v95.6,61.4
N$9
  Top 0.152: R13.1 LED1.A
N$10
  Top 0.152: 61.75,37.7 R9.1 61.4,37.6 59.15,37.6 59,37.45 59,36.7 58.95,36.65 57.95,36.65 U1.7
N$11
  Top 0.152: U1.99 55.71,30.94 56.65,30 R8.1
N$14
  Top 0.406: U6.16 84.14,53.09 X1.X2 80.38,56.65 C31.2
N$16
  Top 0.406: U6.17 80.61,52.3 X1.X1 80.45,52.45 C30.2
N$17
  Top 0.305: U$1.P$18 46.65,20.75 46.3,21.1 45.4,21.1 44,22.5 R18.1
N$19  (via drill 0.3)
  Top 0.152: 60.45,36.15 C9.1 60.24,36.15 U1.6 | U1.38 C7.1 | U1.67 | 36.25,39.8 C20.+
  Top 0.3: U1.67 C8.1 39.95,38.9 39.4,39.45 v39.45,39.5 39.4,39.6 v39.4,41.65 | v36.25,41.6 36.25,39.8 | L3.2 33,41.4 v33.2,41.6 | v50.45,42.95 50.45,46.3 50.25,46.5 50.25,46.65 50.2,46.7 U1.38 | v59.6,36.95 59.7,36.85
  Top 0.305: 59.7,36.85 60.35,36.85 C9.1
  Bottom 0.3: v36.25,41.6 36.3,41.65 | v33.2,41.6 v36.25,41.6 | 47.5,40 v50.45,42.95 | 47.5,40 40.2,40 39.85,39.65 39.5,39.65 39.45,39.6 v39.45,39.5 | v59.6,36.95 59.45,36.8 58.65,36.8 57.95,37.5 57.95,38.4 57.25,39.1 56.35,39.1 55.55,39.9 47.6,39.9 47.5,40 | v39.4,41.65 36.5,41.65 36.45,41.6 v36.25,41.6
N$20  (via drill 0.3)
  Top 0.152: U1.78 | C6.1 | C5.1 | C4.1 | U1.57 | 39.95,42.7 C3.1
  Top 0.3: C25.1 44.75,30.25 45.2,30.7 U1.78 | v59.15,42.14 U1.18 | v59.15,42.14 C6.1 | 54.7,48.8 U1.29 | 54.7,48.8 C5.1 | 47.71,48.6 U1.43 47.7,47.3 47.7,46.7 47.75,46.65 47.75,46.5 47.85,46.4 v47.85,46.15 | 47.71,48.6 C4.1 | C3.1 U1.57 | v36.1,48.05 C21.+ | 39.95,42.7 v39.95,46.05 39.95,48.1 v39.9,48.15 | L2.2 33,47.9 v33.15,48.05 | v54.75,48.8 54.7,48.8 | 47.71,48.6 v47.75,48.6 | v59.15,42.15 v59.15,42.14 | v44.65,46.05 44.7,45.95 44.7,33.35 45.2,32.85 45.2,32.05 U1.78
  Bottom 0.3: v33.15,48.05 v36.1,48.05 36.2,48.1 36.25,48.1 36.3,48.15 v39.9,48.15 | 44.65,46.15 v47.85,46.15 47.85,46.05 47.9,46 48.25,46 48.6,45.65 49.05,45.65 52.55,42.15 v59.15,42.15 | 44.65,46.15 39.9,46.15 v39.95,46.05 | v54.75,48.8 53.9,47.95 48.4,47.95 v47.75,48.6 | v44.65,46.05 44.65,46.15
N$21  (via drill 0.3)
  Top 0.152: C14.1 53.7,30.1 v53.7,30.75 | v47.85,30.65 47.9,30.65 | U1.84 | 47.4,29.95 C10.1 | L4.2 33.15,33.3 | 50.2,30.2 50.2,30.05 C12.1 50.35,30.05 50.2,30.2
  Top 0.3: 53.7,30.1 U1.95 | U1.88 v50.2,30.65 50.2,30.2 | 47.9,30.65 48.2,30.95 U1.84 | U1.82 47.2,30.85 47.4,30.65 | 47.4,30.65 v47.85,30.65 48.4,30.65 48.5,30.55 C11.1 | 47.4,30.65 47.4,29.95 | v37.6,33.3 C18.+ 33.15,33.3
  Bottom 0.152: v50.2,30.65 50.2,30.75
  Bottom 0.3: v50.2,30.65 v47.85,30.65 37.6,30.65 v37.6,33.3 | 50.2,30.75 v53.7,30.75
N$22  (via drill 0.3)
  Top 0.152: 54.7,30.4 U1.97 | 54.7,30.4 C17.1 | 54.7,30.4 54.7,30.7 v55.2,30.7 | v34.35,26.8 C19.+ 33.2,26.8 L5.2
  Top 0.3: v36.4,28.3 36.4,28.05 36.35,28 36.35,27.65 36.25,27.55 C19.+
  Bottom 0.3: v55.2,30.7 55,30.7 53.9,29.6 42.65,29.6 41.35,28.3 v36.4,28.3
N$31
  Top 0.305: U$1.P$19 44.94,19.51 R18.2
NCS  (via drill 0.3)
  Top 0.152: X2.P8 90.4,14 90.8,13.6 94.4,13.6 95.2,14.4 v95.2,19.8 | v91,22.1 88.7,24.4 v88.7,35.3 | v90.4,50.6 90.4,57.81 U6.8
  Bottom 0.152: v95.2,19.8 91.5,19.8 91,20.3 v91,22.1 | v88.7,35.3 88.7,46.3 90.4,48 v90.4,50.6
NPOWERDOWN  (via drill 0.3)
  Top 0.152: U1.2 58.96,34.14 59.1,34 v59.1,27.2 | v95.3,48.6 U6.32 | U6.32
  Bottom 0.152: v59.1,27.2 88.2,27.2 90.1,25.3 99.1,25.3 99.5,25.7 99.5,40 98.7,40.8 96,40.8 95.3,41.5 v95.3,48.6
RED0
  Top 0.152: X2.P19 88,18.05 86.05,20 86.05,32.15 69.35,48.85 56.1,48.85 55.65,49.3 55.65,50.3 55.45,50.5 53.9,50.5 53.8,50.4 53.8,48.7 54.19,48.31 U1.30
RED1  (via drill 0.3)
  Top 0.152: v88.5,11.8 88.5,12.6 88.25,12.85 88.25,14.05 88.4,14.2 X2.P18 | v55.2,35.55 55.2,45.1 54.1,46.2 54.1,46.25 53.7,46.65 53.7,47.35 U1.31 | v59.7,35.35 59.7,34.65 v60.2,34.15 | v67,18.75 v67,28.8
  Bottom 0.152: v88.5,11.8 88.5,12.6 88.25,12.85 88.25,14.05 88.15,14.15 87.7,14.6 87.1,14.6 85.55,16.15 74.75,16.15 72.15,18.75 v67,18.75 | v55.2,35.55 59.5,35.55 v59.7,35.35 | v60.2,34.15 60.4,34.35 64.5,34.35 67,31.85 v67,28.8
RED2
  Top 0.152: X2.P17 88.4,18.15 86.4,20.15 86.4,32.3 69.45,49.25 56.5,49.25 56.05,49.7 56.05,52.2 55.9,52.35 53.6,52.35 53.25,52 53.25,47.42 U1.32
RED3  (via drill 0.3)
  Top 0.152: X2.P16 88.8,14.05 88.6,13.85 88.6,13.5 v88.85,13.25 | v54.55,36.4 54.55,44.8 52.7,46.65 52.7,47.35 U1.33 | v61,35.25 61,35.2 61.1,35.1 v61.1,33.8 | v66.45,31.6 66.5,31.55 66.5,29.5 66.15,29.15 66.15,19.8 v66.35,19.6
  Bottom 0.152: v88.85,13.25 88.6,13.5 88.6,13.85 88.8,14.05 88.8,14.45 88.2,15.05 87.15,15.05 85.7,16.5 75.35,16.5 72.25,19.6 v66.35,19.6 | v54.55,36.4 59.85,36.4 v61,35.25 | v61.1,33.8 61.3,34 64.4,34 66.45,31.95 v66.45,31.6
RED4  (via drill 0.3)
  Top 0.152: X2.P14 89.2,13.75 89.4,13.55 89.4,13 89.1,12.7 v89.1,12.45 | v53.55,44.85 52.1,46.3 52.1,46.5 52.2,46.6 52.2,47.35 U1.34 | v64,29.7 v64,41.5 | v65.5,20.45 v65.5,28.8
  Bottom 0.152: v89.1,12.45 89.1,12.7 89.4,13 89.4,13.55 89.15,13.8 89.15,14.55 88.3,15.4 87.25,15.4 85.75,16.9 75.85,16.9 72.3,20.45 v65.5,20.45 | v64,41.5 60.1,45.4 56.35,45.4 55.8,44.85 v53.55,44.85 | v64,29.7 64.9,28.8 v65.5,28.8
RED5
  Top 0.152: X2.P13 89.2,17.85 86.75,20.3 86.75,32.45 69.5,49.7 56.8,49.7 56.55,49.95 56.55,52.4 56.2,52.75 52.25,52.75 51.75,52.25 51.75,47.42 U1.35
RED6  (via drill 0.3)
  Top 0.152: X2.P12 89.6,13.85 89.75,13.7 89.75,12.05 v89.5,11.8 | v51.45,46.15 51.45,46.35 51.2,46.6 51.2,47.35 U1.36 | v64.85,41.8 64.85,28.35 64.8,28.3 64.8,21.35 v64.85,21.3
  Bottom 0.152: v89.5,11.8 89.75,12.05 89.75,14.45 88.45,15.75 87.35,15.75 85.85,17.25 76.05,17.25 75.35,17.95 72.1,21.25 72.05,21.3 v64.85,21.3 | v51.45,46.15 51.9,45.7 53.65,45.7 54,45.35 55.75,45.35 56.2,45.8 60.35,45.8 60.45,45.7 60.95,45.7 v64.85,41.8
RED7
  Top 0.152: X2.P11 89.6,17.95 87.15,20.4 87.15,32.55 69.65,50.05 57.25,50.05 57,50.3 57,52.65 56.45,53.2 51.75,53.2 51.1,52.55 51.1,48.7 50.75,48.35 50.75,47.41 U1.37
RESET  (via drill 0.3)
  Top 0.152: X2.P9 90,18.1 87.6,20.5 87.6,32.7 85.6,34.7 v85.6,35.1 | v96.1,54.6 U6.1
  Bottom 0.152: v85.6,35.1 85.6,51.1 86.4,51.9 94.7,51.9 96.1,53.3 v96.1,54.6
SCDT  (via drill 0.3)
  Top 0.152: U1.8 56.74,37.16 v56.7,37.2 | v38.2,35.9 37.5,36.6 37.5,53.1 38.5,54.1 69.5,54.1 84.2,39.4 v90.5,39.4 | v90.5,45.2 U6.26
  Bottom 0.152: v56.7,37.2 42.8,37.2 41.5,35.9 v38.2,35.9 | v90.5,39.4 v90.5,45.2
SCL
  Top 0.406: R5.2 80.15,48.65 83.01,51.51 U6.18
SCL_BB  (via drill 0.3)
  Top 0.152: U6.21 85.2,49.1 v84.8,49.5 | v76,25.3 v76,35 | v48.2,17.1 U$1.P$15 | v39.9,17.1 39.15,17.1 R14.2
  Bottom 0.152: v84.8,49.5 76,40.7 v76,35 | v76,25.3 58.1,25.3 57.9,25.1 57.9,24.3 55.9,22.3 55.9,17.3 55.7,17.1 v48.2,17.1 v39.9,17.1
SCLK  (via drill 0.3)
  Top 0.152: U6.9 89.71,49.11 v89.7,49.1 | X2.P7 90.4,18.2 88,20.6 v88,34.1
  Bottom 0.152: v89.7,49.1 88,47.4 v88,34.1
SDA
  Top 0.152: R6.2 83.45,48.6
  Top 0.406: R6.2 83.5,50.05 84.15,50.7 U6.19
SDA_BB  (via drill 0.3)
  Top 0.152: U$1.P$16 47.65,16.45 v48.2,15.9 48,15.7 38.3,15.7 37.6,16.4 R15.2 | v76.8,24.2 v76.8,34.2 | v84.8,47.3 84.8,47.8 85.3,48.3 86.47,48.3 U6.22
  Bottom 0.152: v48.2,15.9 55.6,15.9 56.4,16.7 56.4,22.1 58.5,24.2 v76.8,24.2 | v76.8,34.2 76.8,39.3 v84.8,47.3
TMDS_CLOCK+  (via drill 0.3)
  Top 0.152: U$1.P$10 50.7,21.1 54.25,24.65 55.75,24.65 v56.6,23.8 | U1.93 52.69,30.89 52.55,30.75 52.55,24.95 v52.25,24.65
  Bottom 0.152: v52.25,24.65 55.75,24.65 v56.6,23.8
TMDS_CLOCK-  (via drill 0.3)
  Top 0.152: U$1.P$12 49.7,20.6 54.1,25 56.55,25 v57.1,24.45 | v53.15,25.2 53.15,31 53.25,31.1 53.25,31.88 U1.94
  Bottom 0.152: v57.1,24.45 56.35,25.2 v53.15,25.2
TMDS_DATA0+  (via drill 0.3)
  Top 0.152: v52.05,21.6 52.2,21.45 U$1.P$7 | v48.05,21.35 48.15,21.55 48.85,21.55 50.9,23.6 50.9,24.35 50.8,24.45 50.4,24.45 50.25,24.6 50.25,25 50.4,25.15 51.1,25.15 51.2,25.25 51.2,25.6 51.1,25.7 50.3,25.7 50.2,25.8 50.2,26.25 50.35,26.4 51.1,26.4 51.2,26.5 51.2,31.92 U1.90
  Bottom 0.152: v52.05,21.6 51.95,21.55 48.15,21.55 v48.05,21.35
TMDS_DATA0-  (via drill 0.3)
  Top 0.152: U$1.P$9 51.2,20.55 v51.55,21 | v47.25,21.45 47.7,20.8 48.95,20.8 51.7,23.55 51.7,23.8 51.6,23.9 51.4,23.9 51.25,24.05 51.25,24.8 51.35,24.9 51.55,24.9 51.7,25.05 U1.91
  Bottom 0.152: v47.25,21.45 47.6,20.95 47.7,20.8 49.2,20.8 49.4,21 v51.55,21
TMDS_DATA1+  (via drill 0.3)
  Top 0.152: U$1.P$4 53.7,22.35 54.25,22.9 54.8,22.9 v55.2,23.3 | v48.4,23.05 48.55,23.05 49.2,23.7 49.2,30.4 48.7,30.9 U1.85
  Bottom 0.152: v48.4,23.05 48.6,22.85 54.35,22.85 54.8,23.3 v55.2,23.3
TMDS_DATA1-  (via drill 0.3)
  Top 0.152: U$1.P$6 52.7,22.35 54.45,24.1 v55.35,24.1 | v49.7,23.4 49.7,23.65 49.55,23.8 49.55,30.6 49.2,30.95 49.2,31.92 U1.86
  Bottom 0.152: v55.35,24.1 54.95,24.1 54.05,23.2 49.9,23.2 v49.7,23.4
TMDS_DATA2+  (via drill 0.3)
  Top 0.152: v55.2,22.5 U$1.P$1 | v46.2,22.55 46.2,31.92 U1.80
  Bottom 0.152: v55.2,22.5 46.2,22.5 v46.2,22.55
TMDS_DATA2-  (via drill 0.3)
  Top 0.152: v54.45,21.95 54.45,21.85 54.2,21.65 U$1.P$3 | v46.4,21.8 46.75,22.15 46.75,22.9 46.6,23.05 46.6,30.55 46.7,30.65 U1.81
  Bottom 0.152: v46.4,21.8 46.75,22.15 54.25,22.15 v54.45,21.95
UCAP
  Top 0.406: U6.6 92.1,58.9 93.4,60.2 C29.1
VBUS  (via drill 0.3, 0.6)
  Top 0.3: 92.7,28.1 U2.2 | 92.7,28.1 91.85,28.1 C1.1 | v92.7,28.25 92.7,28.1 | v96.5,26 96.5,26.6 U2.6 96.55,26.75 U2.7 | v41.7,29.85 43.3,28.25 43.3,27.6 v43.2,27.5 | 28.1,21.8 25.2,21.8 23.2,19.8 23.2,15.67 EXT-PWR.1
  Top 0.406: U5.3 C15.1 | 71.3,59.8 v73.65,59.8 | v95.3,59.8 U6.2 | U6.7 91.31,59.71 v91.4,59.8 | 28.1,20.95 28.1,20.8 29.3,19.6 X4.1
  Top 0.813: 28.1,20.95 28.1,21.8 v28.1,29.85 28.1,57.75 31.7,61.35 70.15,61.35 71.3,60.2 71.3,59.8 U5.3
  Bottom 0.3: 92.7,28.1 43.85,28.15 v43.2,27.5 | v96.5,26 94.9,27.6 93.15,27.6 92.7,28.1 | 92.7,28.1 v92.7,28.25
  Bottom 0.406: v28.1,29.85 v41.7,29.85 | v95.3,59.8 v91.4,59.8 v73.65,59.8
VDD  (via drill 0.3, 0.6)
  Top 0.152: L5.1 33.25,24.6 | R12.2 57.9,26.4 v58.2,26.1 | X2.P46 82.8,14.45 82.05,13.7 77.95,13.7 76,15.65 76,17.3 75.05,18.25 75.05,19 v75.1,19.05 | v63.1,22.1 63.1,26 v63,26.1 | X2.P47 82.4,17.6 v81.4,18.6 | v34.4,24.6 34.4,23.3 37.6,20.1 R15.1 R14.1 | 80.1,59.5 80.1,62.2 80.2,62.2 R7.2
  Top 0.305: R9.2 63.05,26.15 v63,26.1 | R8.2 56.65,26.35 56.9,26.1 v58.2,26.1
  Top 0.406: U6.44 98.81,56.29 99.3,55.8 | 99.3,55.8 99.45,55.65 99.45,48.95 98.85,48.35 97.75,48.35 U6.34 98.1,47.93 C26.1 93.9,44.4 | R5.1 R6.1 78.05,47.35 v74.6,50.8 74.6,61.7 | U5.4 C16.1 73.35,64.2 73.35,62.95 74.6,61.7 | U6.24 C28.1 89,44.4 93.9,44.4 | U6.14 84.51,54.69 83.7,55.5 | 83.7,55.5 82.6,56.6 82.6,58.4 81.5,59.5 80.1,59.5 77.8,59.5 C27.1 77.75,61.25 77.3,61.7 74.6,61.7 | 32.4,31.2 32.3,31.2 31.8,30.7 31.8,24.9 32.1,24.6 L5.1 v34.4,24.6 | 32.4,31.2 32.95,31.2 L4.1 | 32.25,37.75 31.8,37.3 31.8,31.8 32.4,31.2 | 32.25,37.75 L3.1 | 32.25,37.75 31.8,38.2 31.8,44.1 32.2,44.5 | 32.2,44.5 32.95,44.5 L2.1 | R4.2 93.85,44.35 93.9,44.4 | R8.2 55.9,27 v55.3,26.4 | v32.2,50.8 32.2,50.7 31.8,50.3 31.8,44.9 32.2,44.5 | v83.8,55.7 83.8,55.6 83.7,55.5 | v99.2,55.7 99.3,55.8
  Bottom 0.152: v63.1,22.1 63.15,22.05 65,22.05 65.2,21.85 71.95,21.85 74.75,19.05 v75.1,19.05 75.55,18.6 v81.4,18.6
  Bottom 0.305: v58.2,26.1 v63,26.1
  Bottom 0.406: v55.3,26.4 36.2,26.4 v34.4,24.6 | v32.2,50.8 v74.6,50.8 | v83.8,55.7 v99.2,55.7
VSYNC  (via drill 0.3)
  Top 0.152: v73.25,34.6 73.25,21.4 v73.5,21.15 | v82.25,18.65 82.8,18.1 X2.P45 | U1.47 45.7,47.4 45.7,48.1 45.8,48.2 v45.8,48.6 45.7,48.7 45.7,48.8 45.6,48.9 45.6,49 44.6,50 44.6,50.2 VSYNC.TP
  Bottom 0.152: v45.8,48.6 47.4,47 55.85,47 56.1,47.25 58.25,47.25 58.45,47.05 60.8,47.05 v73.25,34.6 | v73.5,21.15 73.55,21.1 80.05,21.1 80.45,20.7 80.45,20.35 82.15,18.65 v82.25,18.65

### Text on the board
tNames: Reset | Status | Manga Screen | Rev A2 | GND | +5V